# EAGLE schematic sensor_interface (EAGLE 9.0.1)
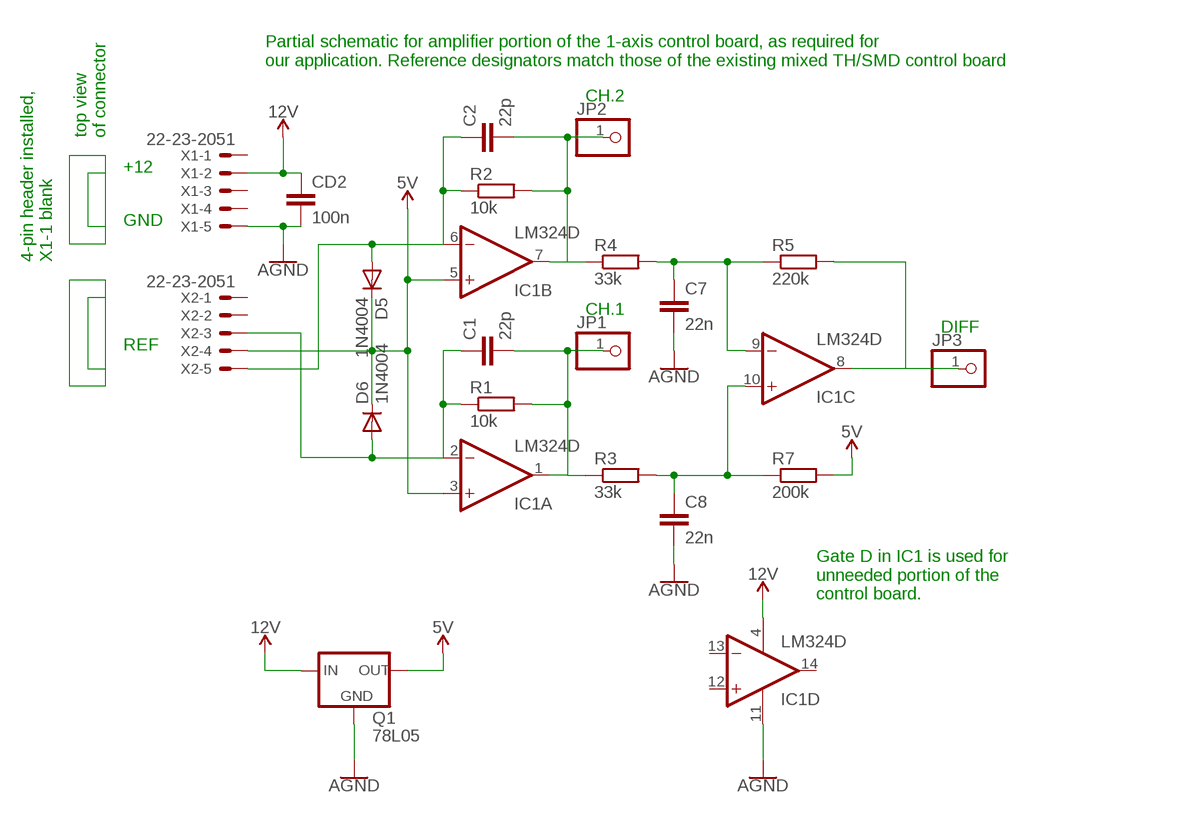
[diagram p0: schematic, sheet 1]

## Parts
C1  22p  C-EU025-024X044  [C025-024X044]
C2  22p  C-EU025-024X044  [C025-024X044]
C7  22n  C-EU025-024X044  [C025-024X044]
C8  22n  C-EU025-024X044  [C025-024X044]
CD2  100n  C-EU025-024X044  [C025-024X044]
D5  1N4004  [DO41-10]
D6  1N4004  [DO41-10]
IC1  LM324D  [SO14]
JP1  PINHD-1X1  [1X01]
JP2  PINHD-1X1  [1X01]
JP3  PINHD-1X1  [1X01]
Q1  78L05  78LXX  [78LXX]
R1  10k  R-EU_R0805  [R0805]
R2  10k  R-EU_R0805  [R0805]
R3  33k  R-EU_R0805  [R0805]
R4  33k  R-EU_R0805  [R0805]
R5  220k  R-EU_R0805  [R0805]
R7  200k  R-EU_R0805  [R0805]
X1  22-23-2051  [22-23-2051]
X2  22-23-2051  [22-23-2051]

## Nets
5V: D5.C D6.C IC1.3(A:+IN) IC1.5(B:+IN) Q1.OUT R7.2 X2.4
12V: CD2.1 IC1.4(P:V+) Q1.IN X1.2
AGND: C7.2 C8.2 CD2.2 IC1.11(P:V-) Q1.GND X1.5
N$1: C2.1 D5.A IC1.6(B:-IN) R2.1 X2.5
N$2: C1.1 D6.A IC1.2(A:-IN) R1.1 X2.3
N$5: C1.2 IC1.1(A:OUT) JP1.1 R1.2 R3.1
N$7: C8.1 IC1.10(C:+IN) R3.2 R7.1
N$8: C7.1 IC1.9(C:-IN) R4.2 R5.1
N$9: C2.2 IC1.7(B:OUT) JP2.1 R2.2 R4.1
N$13: IC1.8(C:OUT) JP3.1 R5.2
Unconnected: IC1.12(D:+IN) IC1.13(D:-IN) IC1.14(D:OUT) X1.1 X1.3 X1.4 X2.1 X2.2

## Notes on the sheet
- Partial schematic for amplifier portion of the 1-axis control board, as required for 
  our application. Reference designators match those of the existing mixed TH/SMD control board
- CH.2
- top view
  of connector
- +12
- GND
- 4-pin header installed,
  X1-1 blank
- CH.1
- DIFF
- REF
- Gate D in IC1 is used for
  unneeded portion of the 
  control board.

## Library data of the parts
C1 C2 C7 C8 CD2 = rcl:C-EU: CAPACITOR, European symbol; SPICEPREFIX: C
D5 D6 = diode:1N4004: DIODE general purpose rectifier, 1 A
IC1 = linear:LM324: OP AMP
JP1-JP3 = pinhead:PINHD-1X1: PIN HEADER
Q1 = v-reg:78LXX: VOLTAGE REGULATOR
R1-R5 R7 = rcl:R-EU_: RESISTOR, European symbol; SPICEPREFIX: R
X1 X2 = con-molex:22-23-2051: .100" (2.54mm) Center Header - 5 Pin; MF: MOLEX; MPN: 22-23-2051; OC_FARNELL: 1462952; OC_NEWARK: 38C9178